# Altium schematic sheet 06 CPU.SchDoc
size 420 x 297 mm
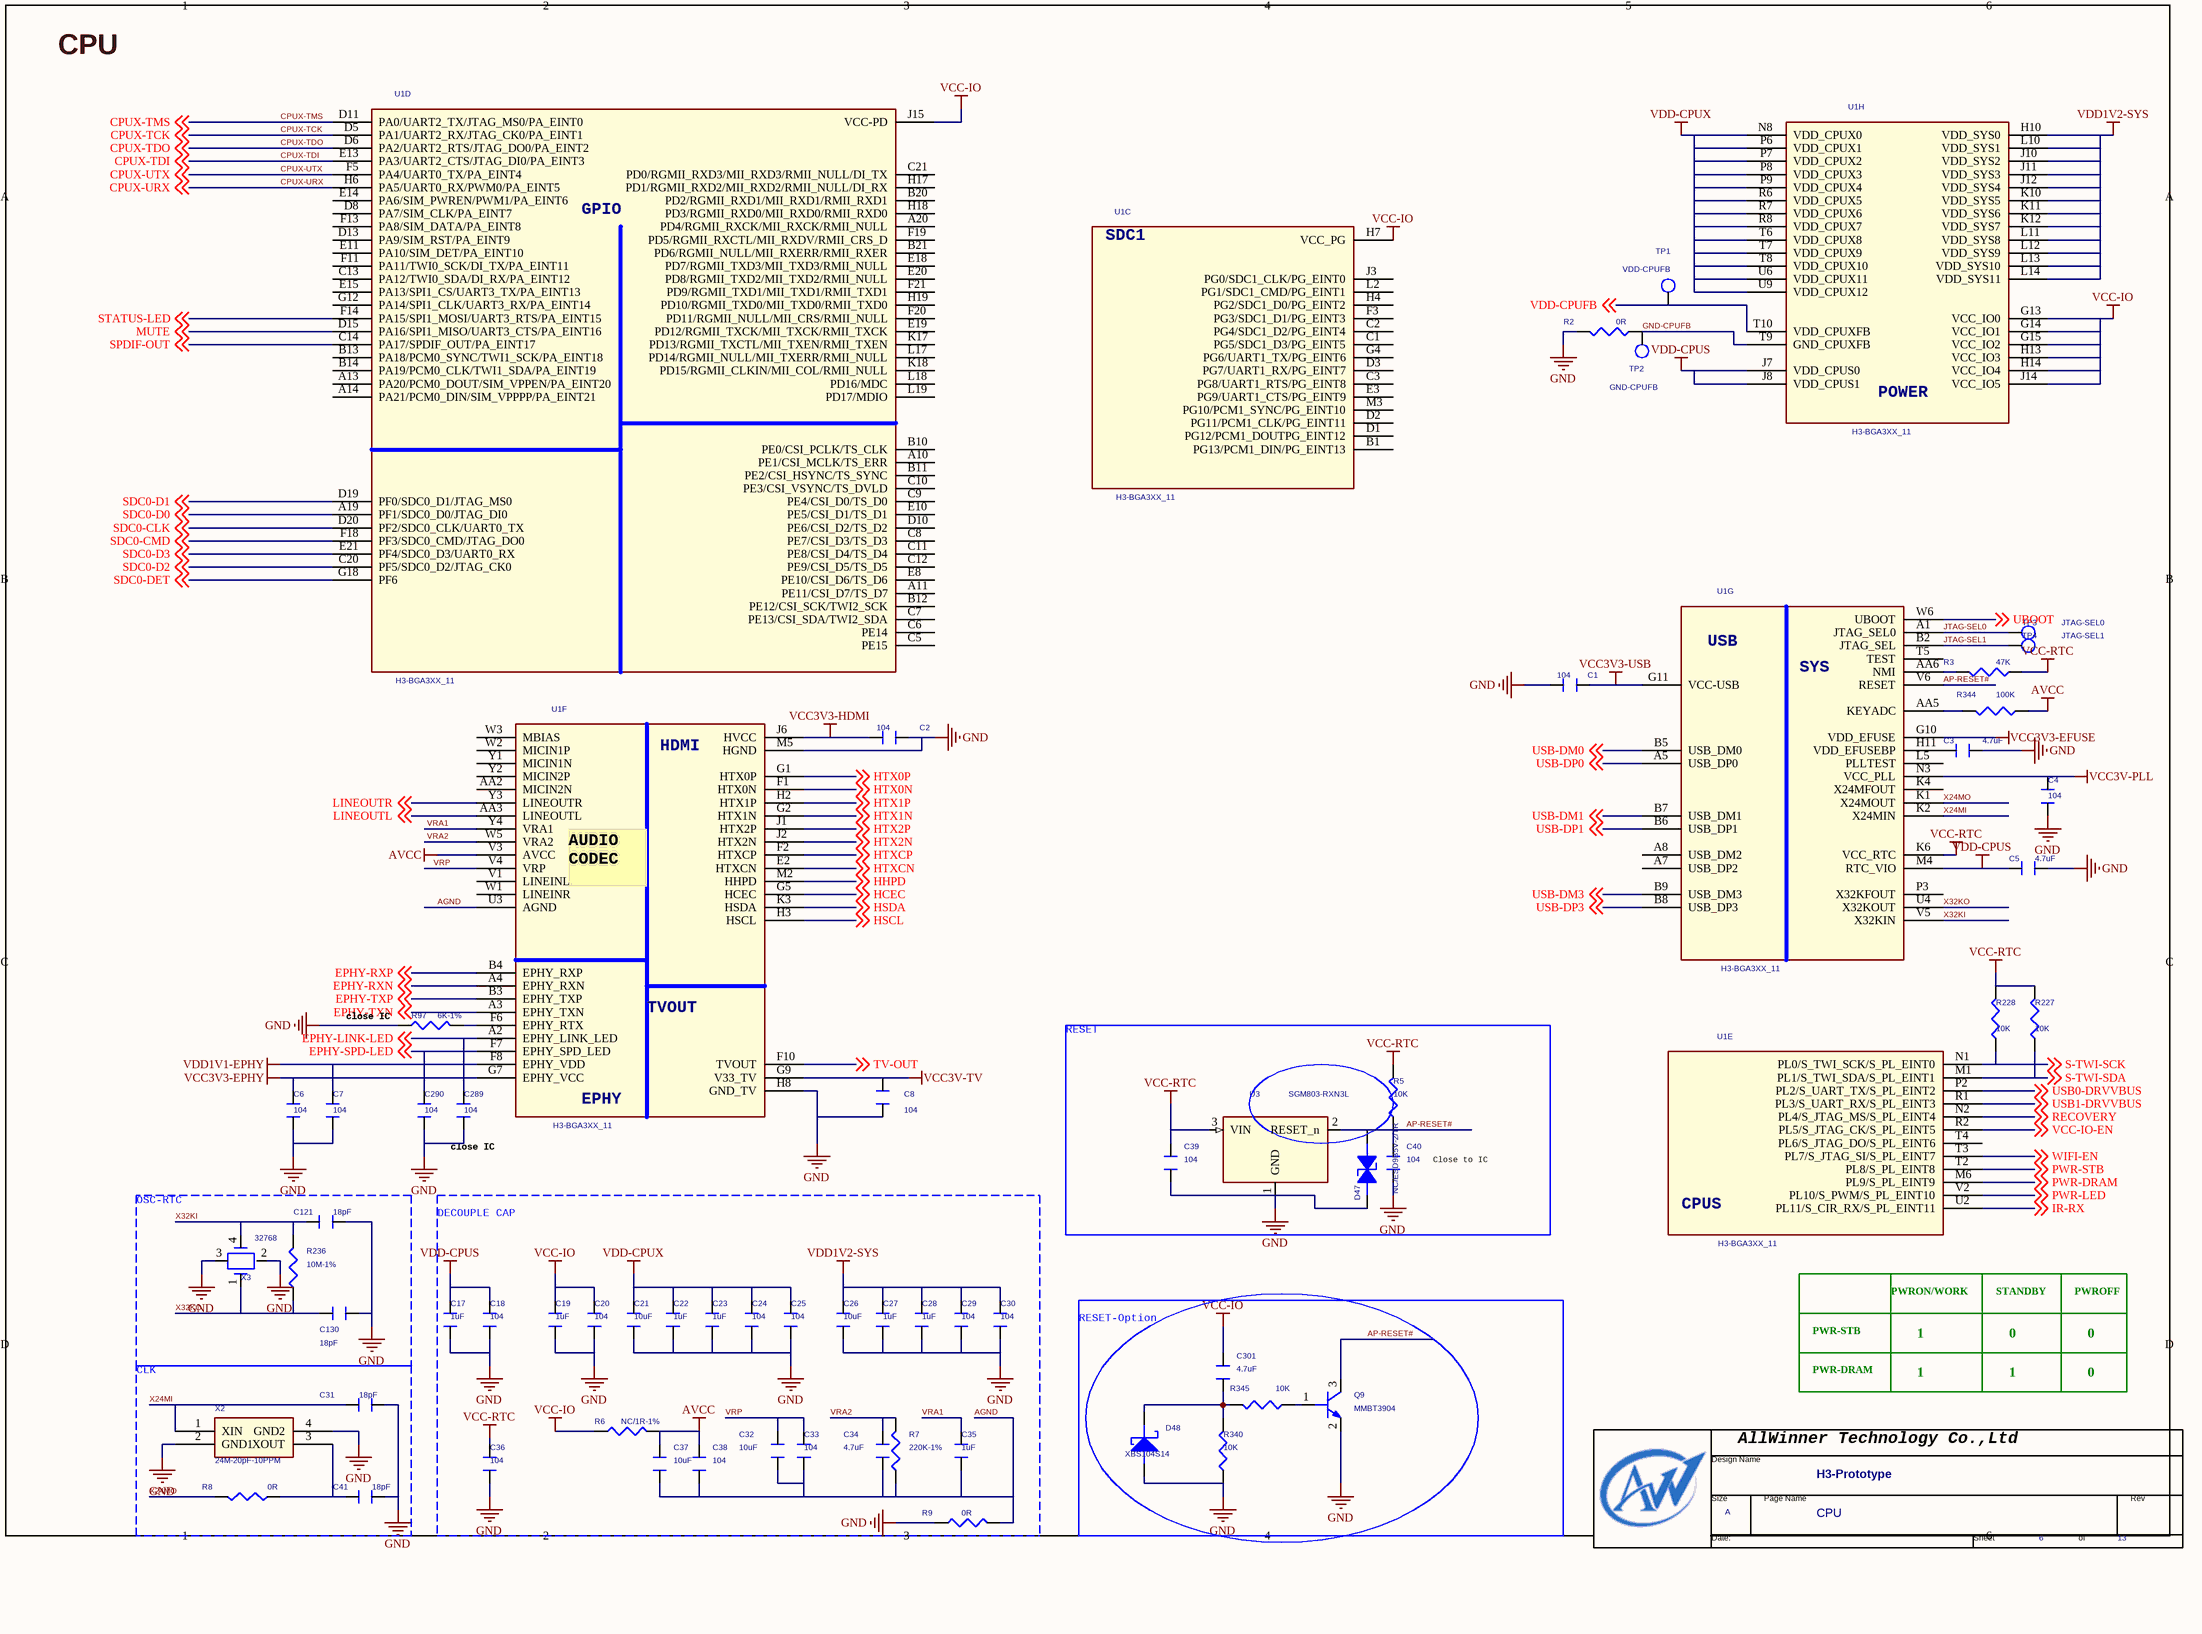
[diagram p0: 06 CPU.SchDoc]

## Parts
*  Page Count: 13  Page Number: 6  Page Size: A  Title: H3-Prototype  Doc: CPU  (hidden comment: TitleBlock0-AW)  (graphical)
C1  104  [C0402]
C2  104  [C0402]
C3  4.7uF  [C0402]
C4  104  [C0402]
C5  4.7uF  [C0402]
C6  104  [C0402]
C7  104  [C0402]
C8  104  [C0402]
C17  1uF  [C0402]
C18  104  [C0402]
C19  1uF  [C0402]
C20  104  [C0402]
C21  10uF  [C0603]
C22  1uF  [C0402]
C23  1uF  [C0402]
C24  104  [C0402]
C25  104  [C0402]
C26  10uF  [C0603]
C27  1uF  [C0402]
C28  1uF  [C0402]
C29  104  [C0402]
C30  104  [C0402]
C31  18pF  [C0402]
C32  10uF  [C0603]
C33  104  [C0402]
C34  4.7uF  [C0402]
C35  1uF  [C0402]
C36  104  [C0402]
C37  10uF  [C0603]
C38  104  [C0402]
C39  104  [C0402]
C40  104  [C0402]
C41  18pF  [C0402]
C121  18pF  [C0402]
C130  18pF  [C0402]
C289  104  [C0402]
C290  104  [C0402]
C301  4.7uF  [C0402]
D47  NC/ESD9B5V-2/TR  [C0402]
D48  XBS104S14  [SOD123]
Q9  MMBT3904  [SOT-23]
R2  0R  [R0402]
R3  47K  [R0402]
R5  10K  [0805]
R6  NC/1R-1%  [R0402]
R7  220K-1%  [R0402]
R8  0R  [R0402]
R9  0R  [R0402]
R97  6K-1%  [0805]
R227  10K  [R0402]
R228  10K  [R0402]
R236  10M-1%  [R0402]
R340  10K  [0805]
R344  100K  [R0402]
R345  10K  [0805]
TP1  VDD-CPUFB  [TP_SMD]
TP2  GND-CPUFB  [TP_SMD]
TP3  JTAG-SEL0  [TP_SMD]
TP4  JTAG-SEL1  [TP_SMD]
U1  H3-BGA3XX_11  [BGA347P0_65B14X14]  (parts C,D,E,F,G,H of 9)
U3  SGM803-RXN3L  [SOT-23]
X2  24M-20pF-10PPM  [CRY-3225]
X3  32768  [XCOL-3]

## Blocks framed on the sheet
RESET: C39 C40 D47 R5 U3
DECOUPLE CAP: C17-C30 C32-C38 R6 R7 R9
RESET-Option: C301 D48 Q9 R340 R345

## Nets
AVCC: C37.2 C38.2 R6.2 R344.1 U1.V3(AVCC)
GND: C1.1 C2.2 C3.2 C4.1 C5.2 C6.1 C7.1 C8.2 C17.1 C18.1 C19.1 C20.1 C21.1 C22.1 C23.1 C24.1 C25.1 C26.1 C27.1 C28.1 C29.1 C30.1 C31.1 C36.1 C39.1 C40.1 C41.1 C121.1 C130.1 C289.1 C290.1 D47.2(CATHODE) D48.A Q9.2(E) R2.2 R9.1 R97.1 R340.1 U1.H8(GND_TV) U1.M5(HGND) U3.1(GND) X2.2(GND1) X2.4(GND2) X3.2 X3.3(Shield)
VCC3V3-EFUSE: U1.G10(VDD_EFUSE)
VCC3V3-EPHY: C6.2 U1.G7(EPHY_VCC)
VCC3V3-HDMI: C2.1 U1.J6(HVCC)
VCC3V3-USB: C1.2 U1.G11(VCC-USB)
VCC3V-PLL: C4.2 U1.N3(VCC_PLL)
VCC3V-TV: C8.1 U1.G9(V33_TV)
VCC-IO: C19.2 C20.2 C301.2 R6.1 U1.G13(VCC_IO0) U1.G14(VCC_IO1) U1.G15(VCC_IO2) U1.H7(VCC_PG) U1.H13(VCC_IO3) U1.H14(VCC_IO4) U1.J14(VCC_IO5) U1.J15(VCC-PD)
VCC-RTC: C36.2 C39.2 R3.1 R5.2 R227.2 R228.2 U1.K6(VCC_RTC) U3.3(VIN)
VDD1V1-EPHY: C7.2 U1.F8(EPHY_VDD)
VDD1V2-SYS: C26.2 C27.2 C28.2 C29.2 C30.2 U1.H10(VDD_SYS0) U1.J10(VDD_SYS2) U1.J11(VDD_SYS3) U1.J12(VDD_SYS4) U1.K10(VDD_SYS5) U1.K11(VDD_SYS6) U1.K12(VDD_SYS7) U1.L10(VDD_SYS1) U1.L11(VDD_SYS8) U1.L12(VDD_SYS9) U1.L13(VDD_SYS10) U1.L14(VDD_SYS11)
VDD-CPUS: C5.1 C17.2 C18.2 U1.J7(VDD_CPUS0) U1.J8(VDD_CPUS1) U1.M4(RTC_VIO)
VDD-CPUX: C21.2 C22.2 C23.2 C24.2 C25.2 U1.N8(VDD_CPUX0) U1.P6(VDD_CPUX1) U1.P7(VDD_CPUX2) U1.P8(VDD_CPUX3) U1.P9(VDD_CPUX4) U1.R6(VDD_CPUX5) U1.R7(VDD_CPUX6) U1.R8(VDD_CPUX7) U1.T6(VDD_CPUX8) U1.T7(VDD_CPUX9) U1.T8(VDD_CPUX10) U1.U6(VDD_CPUX11) U1.U9(VDD_CPUX12)
AGND: C32.1 C33.1 C34.1 C35.1 C37.1 C38.1 R7.1 R9.2 U1.U3(AGND)
AP-RESET#: C40.2 D47.1(ANODE) Q9.3(C) R5.1 U1.V6(RESET) U3.2(RESET_n)
CPUX-TCK: U1.D5(PA1/UART2_RX/JTAG_CK0/PA_EINT1) ; off-sheet CPUX-TCK
CPUX-TDI: U1.E13(PA3/UART2_CTS/JTAG_DI0/PA_EINT3) ; off-sheet CPUX-TDI
CPUX-TDO: U1.D6(PA2/UART2_RTS/JTAG_DO0/PA_EINT2) ; off-sheet CPUX-TDO
CPUX-TMS: U1.D11(PA0/UART2_TX/JTAG_MS0/PA_EINT0) ; off-sheet CPUX-TMS
CPUX-URX: U1.H6(PA5/UART0_RX/PWM0/PA_EINT5) ; off-sheet CPUX-URX
CPUX-UTX: U1.F5(PA4/UART0_TX/PA_EINT4) ; off-sheet CPUX-UTX
EPHY-LINK-LED: C289.2 U1.A2(EPHY_LINK_LED) ; off-sheet EPHY-LINK-LED
EPHY-RXN: U1.A4(EPHY_RXN) ; off-sheet EPHY-RXN
EPHY-RXP: U1.B4(EPHY_RXP) ; off-sheet EPHY-RXP
EPHY-SPD-LED: C290.2 U1.F7(EPHY_SPD_LED) ; off-sheet EPHY-SPD-LED
EPHY-TXN: U1.A3(EPHY_TXN) ; off-sheet EPHY-TXN
EPHY-TXP: U1.B3(EPHY_TXP) ; off-sheet EPHY-TXP
GND-CPUFB: R2.1 TP2.1(TP) U1.T9(GND_CPUXFB)
HCEC: U1.G5(HCEC) ; off-sheet HCEC
HHPD: U1.M2(HHPD) ; off-sheet HHPD
HSCL: U1.H3(HSCL) ; off-sheet HSCL
HSDA: U1.K3(HSDA) ; off-sheet HSDA
HTX0N: U1.F1(HTX0N) ; off-sheet HTX0N
HTX0P: U1.G1(HTX0P) ; off-sheet HTX0P
HTX1N: U1.G2(HTX1N) ; off-sheet HTX1N
HTX1P: U1.H2(HTX1P) ; off-sheet HTX1P
HTX2N: U1.J2(HTX2N) ; off-sheet HTX2N
HTX2P: U1.J1(HTX2P) ; off-sheet HTX2P
HTXCN: U1.E2(HTXCN) ; off-sheet HTXCN
HTXCP: U1.F2(HTXCP) ; off-sheet HTXCP
IR-RX: U1.U2(PL11/S_CIR_RX/S_PL_EINT11) ; off-sheet IR-RX
JTAG-SEL0: TP3.1(TP) U1.A1(JTAG_SEL0)
JTAG-SEL1: TP4.1(TP) U1.B2(JTAG_SEL)
LINEOUTL: U1.AA3(LINEOUTL) ; off-sheet LINEOUTL
LINEOUTR: U1.Y3(LINEOUTR) ; off-sheet LINEOUTR
MUTE: U1.D15(PA16/SPI1_MISO/UART3_CTS/PA_EINT16) ; off-sheet MUTE
PWR-DRAM: U1.M6(PL9/S_PL_EINT9) ; off-sheet PWR-DRAM
PWR-LED: U1.V2(PL10/S_PWM/S_PL_EINT10) ; off-sheet PWR-LED
PWR-STB: U1.T2(PL8/S_PL_EINT8) ; off-sheet PWR-STB
RECOVERY: U1.N2(PL4/S_JTAG_MS/S_PL_EINT4) ; off-sheet RECOVERY
S-TWI-SCK: R228.1 U1.N1(PL0/S_TWI_SCK/S_PL_EINT0) ; off-sheet S-TWI-SCK
S-TWI-SDA: R227.1 U1.M1(PL1/S_TWI_SDA/S_PL_EINT1) ; off-sheet S-TWI-SDA
SDC0-CLK: U1.D20(PF2/SDC0_CLK/UART0_TX) ; off-sheet SDC0-CLK
SDC0-CMD: U1.F18(PF3/SDC0_CMD/JTAG_DO0) ; off-sheet SDC0-CMD
SDC0-D0: U1.A19(PF1/SDC0_D0/JTAG_DI0) ; off-sheet SDC0-D0
SDC0-D1: U1.D19(PF0/SDC0_D1/JTAG_MS0) ; off-sheet SDC0-D1
SDC0-D2: U1.C20(PF5/SDC0_D2/JTAG_CK0) ; off-sheet SDC0-D2
SDC0-D3: U1.E21(PF4/SDC0_D3/UART0_RX) ; off-sheet SDC0-D3
SDC0-DET: U1.G18(PF6) ; off-sheet SDC0-DET
SPDIF-OUT: U1.C14(PA17/SPDIF_OUT/PA_EINT17) ; off-sheet SPDIF-OUT
STATUS-LED: U1.F14(PA15/SPI1_MOSI/UART3_RTS/PA_EINT15) ; off-sheet STATUS-LED
TV-OUT: U1.F10(TVOUT) ; off-sheet TV-OUT
UBOOT: U1.W6(UBOOT) ; off-sheet UBOOT
USB0-DRVVBUS: U1.P2(PL2/S_UART_TX/S_PL_EINT2) ; off-sheet USB0-DRVVBUS
USB1-DRVVBUS: U1.R1(PL3/S_UART_RX/S_PL_EINT3) ; off-sheet USB1-DRVVBUS
USB-DM0: U1.B5(USB_DM0) ; off-sheet USB-DM0
USB-DM1: U1.B7(USB_DM1) ; off-sheet USB-DM1
USB-DM3: U1.B9(USB_DM3) ; off-sheet USB-DM3
USB-DP0: U1.A5(USB_DP0) ; off-sheet USB-DP0
USB-DP1: U1.B6(USB_DP1) ; off-sheet USB-DP1
USB-DP3: U1.B8(USB_DP3) ; off-sheet USB-DP3
VCC-IO-EN: U1.R2(PL5/S_JTAG_CK/S_PL_EINT5) ; off-sheet VCC-IO-EN
VDD-CPUFB: TP1.1(TP) U1.T10(VDD_CPUXFB) ; off-sheet VDD-CPUFB
VRA1: C35.2 U1.Y4(VRA1)
VRA2: C34.2 R7.2 U1.W5(VRA2)
VRP: C32.2 C33.2 U1.V4(VRP)
WIFI-EN: U1.T3(PL7/S_JTAG_SI/S_PL_EINT7) ; off-sheet WIFI-EN
X24MI: C31.2 U1.K2(X24MIN) X2.1(XIN)
X24MO: R8.2 U1.K1(X24MOUT)
X32KI: C121.2 R236.2 U1.V5(X32KIN) X3.4
X32KO: C130.2 R236.1 U1.U4(X32KOUT) X3.1
NetC3_1: C3.1 U1.H11(VDD_EFUSEBP)
NetC41_2: C41.2 R8.1 X2.3(XOUT)
NetC301_1: C301.1 D48.C R340.2 R345.2
NetQ9_1: Q9.1(B) R345.1
NetR3_2: R3.2 U1.AA6(NMI)
NetR97_2: R97.2 U1.F6(EPHY_RTX)
NetR344_2: R344.2 U1.AA5(KEYADC)

Not connected (* = marked no-connect by the designer): U1 A7(USB_DP2) A8(USB_DM2) A10(PE1/CSI_MCLK/TS_ERR) A11(PE11/CSI_D7/TS_D7) A13(PA20/PCM0_DOUT/SIM_VPPEN/PA_EINT20) A14(PA21/PCM0_DIN/SIM_VPPPP/PA_EINT21) A20(PD4/RGMII_RXCK/MII_RXCK/RMII_NULL) AA2(MICIN2N) B1(PG13/PCM1_DIN/PG_EINT13) B10(PE0/CSI_PCLK/TS_CLK) B11(PE2/CSI_HSYNC/TS_SYNC) B12(PE12/CSI_SCK/TWI2_SCK) B13(PA18/PCM0_SYNC/TWI1_SCK/PA_EINT18) B14(PA19/PCM0_CLK/TWI1_SDA/PA_EINT19) B20(PD2/RGMII_RXD1/MII_RXD1/RMII_RXD1) B21(PD6/RGMII_NULL/MII_RXERR/RMII_RXER) C1(PG5/SDC1_D3/PG_EINT5) C2(PG4/SDC1_D2/PG_EINT4) C3(PG8/UART1_RTS/PG_EINT8) C5(PE15) C6(PE14) C7(PE13/CSI_SDA/TWI2_SDA) C8(PE7/CSI_D3/TS_D3) C9(PE4/CSI_D0/TS_D0) C10(PE3/CSI_VSYNC/TS_DVLD) C11(PE8/CSI_D4/TS_D4) C12(PE9/CSI_D5/TS_D5) C13(PA12/TWI0_SDA/DI_RX/PA_EINT12) C21(PD0/RGMII_RXD3/MII_RXD3/RMII_NULL/DI_TX) D1(PG12/PCM1_DOUTPG_EINT12) D2(PG11/PCM1_CLK/PG_EINT11) D3(PG7/UART1_RX/PG_EINT7) D8(PA7/SIM_CLK/PA_EINT7) D10(PE6/CSI_D2/TS_D2) D13(PA9/SIM_RST/PA_EINT9) E3(PG9/UART1_CTS/PG_EINT9) E8(PE10/CSI_D6/TS_D6) E10(PE5/CSI_D1/TS_D1) E11(PA10/SIM_DET/PA_EINT10) E14(PA6/SIM_PWREN/PWM1/PA_EINT6) E15(PA13/SPI1_CS/UART3_TX/PA_EINT13) E18(PD7/RGMII_TXD3/MII_TXD3/RMII_NULL) E19(PD12/RGMII_TXCK/MII_TXCK/RMII_TXCK) E20(PD8/RGMII_TXD2/MII_TXD2/RMII_NULL) F3(PG3/SDC1_D1/PG_EINT3) F11(PA11/TWI0_SCK/DI_TX/PA_EINT11) F13(PA8/SIM_DATA/PA_EINT8) F19(PD5/RGMII_RXCTL/MII_RXDV/RMII_CRS_D) F20(PD11/RGMII_NULL/MII_CRS/RMII_NULL) F21(PD9/RGMII_TXD1/MII_TXD1/RMII_TXD1) G4(PG6/UART1_TX/PG_EINT6) G12(PA14/SPI1_CLK/UART3_RX/PA_EINT14) H4(PG2/SDC1_D0/PG_EINT2) H17(PD1/RGMII_RXD2/MII_RXD2/RMII_NULL/DI_RX) H18(PD3/RGMII_RXD0/MII_RXD0/RMII_RXD0) H19(PD10/RGMII_TXD0/MII_TXD0/RMII_TXD0) J3(PG0/SDC1_CLK/PG_EINT0) K4(X24MFOUT) K17(PD13/RGMII_TXCTL/MII_TXEN/RMII_TXEN) K18(PD15/RGMII_CLKIN/MII_COL/RMII_NULL) L2(PG1/SDC1_CMD/PG_EINT1) L5(PLLTEST) L17(PD14/RGMII_NULL/MII_TXERR/RMII_NULL) L18(PD16/MDC) L19(PD17/MDIO) M3(PG10/PCM1_SYNC/PG_EINT10) P3(X32KFOUT) T4(PL6/S_JTAG_DO/S_PL_EINT6) T5(TEST) V1(LINEINL) W1(LINEINR) W2(MICIN1P) W3(MBIAS) Y1(MICIN1N) Y2(MICIN2P)

## Notes on the sheet
- CPU
- (near R97) close IC
- close IC
- Close to IC
- OSC-RTC
- PWRON/WORK
- STANDBY
- PWROFF
- PWR-STB
- 1
- 0
- CLK
- PWR-DRAM
- (in symbol H3-BGA3XX_12, part C) SDC1
- (in symbol H3-BGA3XX_12, part D) GPIO
- (in symbol H3-BGA3XX_12, part E) CPUS
- (in symbol H3-BGA3XX_12, part F) HDMI; AUDIO / CODEC; EPHY
- (in symbol H3-BGA3XX_12, part G) USB; SYS
- (in symbol H3-BGA3XX_12, part H) POWER
- (in symbol TitleBlock0-AW) AllWinner Technology Co.,Ltd; Design Name; Size; Page Name; Rev; Date:; Sheet; of

## Library data of the parts
C1-C8 C17-C30 C33-C36 C289 C290 = CAPACITOR_0_Dup5
C31 C32 C38 C41 C121 C130 = CAPACITOR_0_Dup5: PAGE: 2
C37 = CAPACITOR_0_Dup2: PAGE: 1
C39 C40 C301 = CAPACITOR_0_Dup1: PAGE: 6
D47 = 1_1.5KE100A_Dup1: 1ST PART DESCRIPTION: WILL ESD9B5V Bidirection ESD Protection
D48 = DIODE_SCHOTTKY_1
Q9 = NPN
R2 R3 R7-R9 R236 = R_Dup3
R5 R340 R345 = R1 0805_Dup1: PAGE: 6
R6 R227 R228 R344 = R_Dup4
R97 = R1_0805_Dup2
TP1-TP4 = T_POINT_R
U1 = H3-BGA3XX_12
U3 = MAX809RD_0: PAGE: 6
X2 = CRYSTAL-4_0: Crystal 24MHz 20pF 10ppm  -30 to +85; PART NUMBER: 7M24000004; Vendor: TXC; SPREADWIN PN: U3000019A
X3 = CRYSTAL_XCOL-3_2
* = TitleBlock0-AW: Page Create Date: March  8, 1995